# EAGLE design usb_socket (EAGLE 8.4.2)
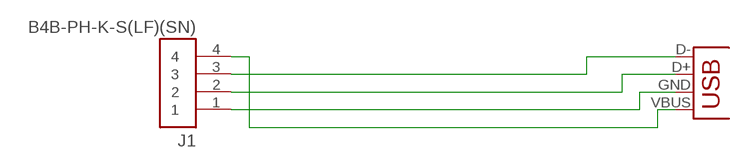
[diagram p0: schematic, sheet 1]

## Parts
J1  B4B-PH-K-S(LF)(SN)  [JST_B4B-PH-K-S(LF)(SN)]
X2  USB-A-H  [USB-A-H]

## Nets
D_N: J1.3 X2.D-(D+)
D_P: J1.2 X2.D+(D-)
GND: J1.1 X2.GND(VBUS)
USB_5V: J1.4 X2.VBUS(GND)

## Library data of the parts
J1 = B4B-PH-K-S_LF__SN_:B4B-PH-K-S(LF)(SN): PH Series 4 Position 2 mm Pitch Through Hole Crimp Top Entry Shrouded Header; DESCRIPTION: PH Series 4 Position 2 mm Pitch Through Hole Crimp Top Entry Shrouded Header; DIGI-KEY_PART_NUMBER: 455-1706-ND; DIGI-KEY_PURCHASE_URL: https://www.digikey.jp/product-detail/en/jst-sales-america-inc/B4B-PH-K-S_LF__SN_/455-1706-ND/926613?utm_source=snapeda&utm_medium=aggregator&utm_campaign=symbol; MF: JST Sales; MP: B4B-PH-K-S_LF__SN_; PACKAGE: None
X2 = usb:USB: USB Connectors USB-B-PTH is fully proven SKU : PRT-00139 USB-miniB is fully proven SKU : PRT-00587 USB-A-PCB is untested. USB-A-H is throughly reviewed, but untested. Spark Fun Electronics SKU : PRT-00437 USB-B-SMT is throughly reviewed, but untested. Needs silkscreen touching up. USB-A-S has not been used/tested USB-MB-H has not been used/tested

## Net classes
1 GND: width 0.508 mm, drill 0.3 mm, clearance 0.2 mm to class 0, clearance 0.2 mm

## Board
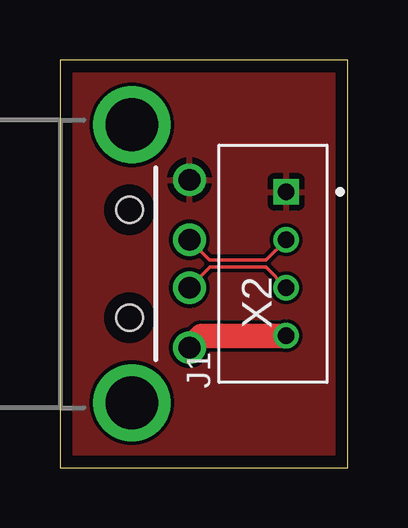
[diagram p1: board, top side]
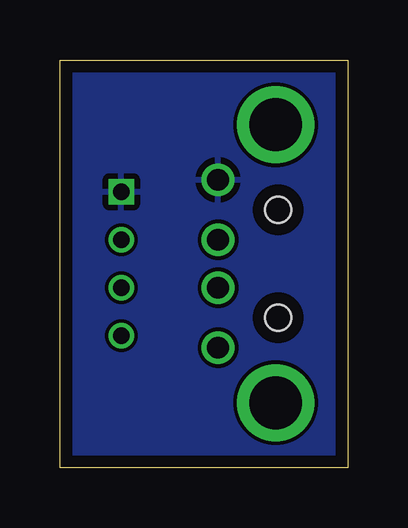
[diagram p2: board, bottom side, seen from below]

Size 12 x 17 mm. Coordinates in mm from the lower left corner, seen from the top.
Outline: 0,0 12,0 12,17 0,17 0,0
Copper layers (1*16): Top 0.035mm / dielectric 1.6mm / Bottom 0.035mm
Design rules "Elecrow_2-layer_PCB_eagle_rule": minimum track width 6mil, minimum drill 12mil, track to track 6mil, track to pad 6mil, pad to pad 6mil, via to via 8mil, smd to smd 0mil, copper to edge 20mil, drill to drill 10mil, minimum pad ring 6mil, minimum via ring 6mil, stop-mask expansion 0mil, vias tented up to drill 100mil, thermal gap 10mil

### Footprints (pad centres in the part's own frame; a part is rotated, then mirrored left to right if it is on the bottom)
JST_B4B-PH-K-S(LF)(SN) = drill 0.7 square: 1 3,-0.55 | drill 0.7: 2 1,-0.55; 3 -1,-0.55; 4 -3,-0.55
USB-A-H = drill 0.914: D+ 2.4,1; D- 2.4,-1; GND 2.4,3.5; VBUS 2.4,-3.5 | drill 2.2: GND@1 0,5.8; GND@2 0,-5.8 | hole 1.1: -0.1,2.25; -0.1,-2.25

### Placement (x,y rotation side)
J1  8.89,8.5 90 top
X2  3,8.5 0 top

### Tracks (layer width: path | path; a pad name or v marks a point on that pad's centre or on a via)
D_N
  Top 0.152: J1.3 8.58,8.36 6.26,8.36 X2.D-
D_P
  Top 0.152: J1.2 8.6,8.66 6.24,8.66 X2.D+
GND
  pour Top: 0,17.02 12.06,17.02 12.06,0 0,0
  pour Bottom: 12.06,17.02 0,17.02 0,0 12.06,0
USB_5V
  Top 1.016: J1.4 5.9,5.5 X2.VBUS